# EasyEDA schematic 原理图1.json
TITLE: Sheet_1; REV: 1.0; Date: 2021-03-16; Sheet: 1/1; Drawn By: MonoLogueChi; Company: Your Company
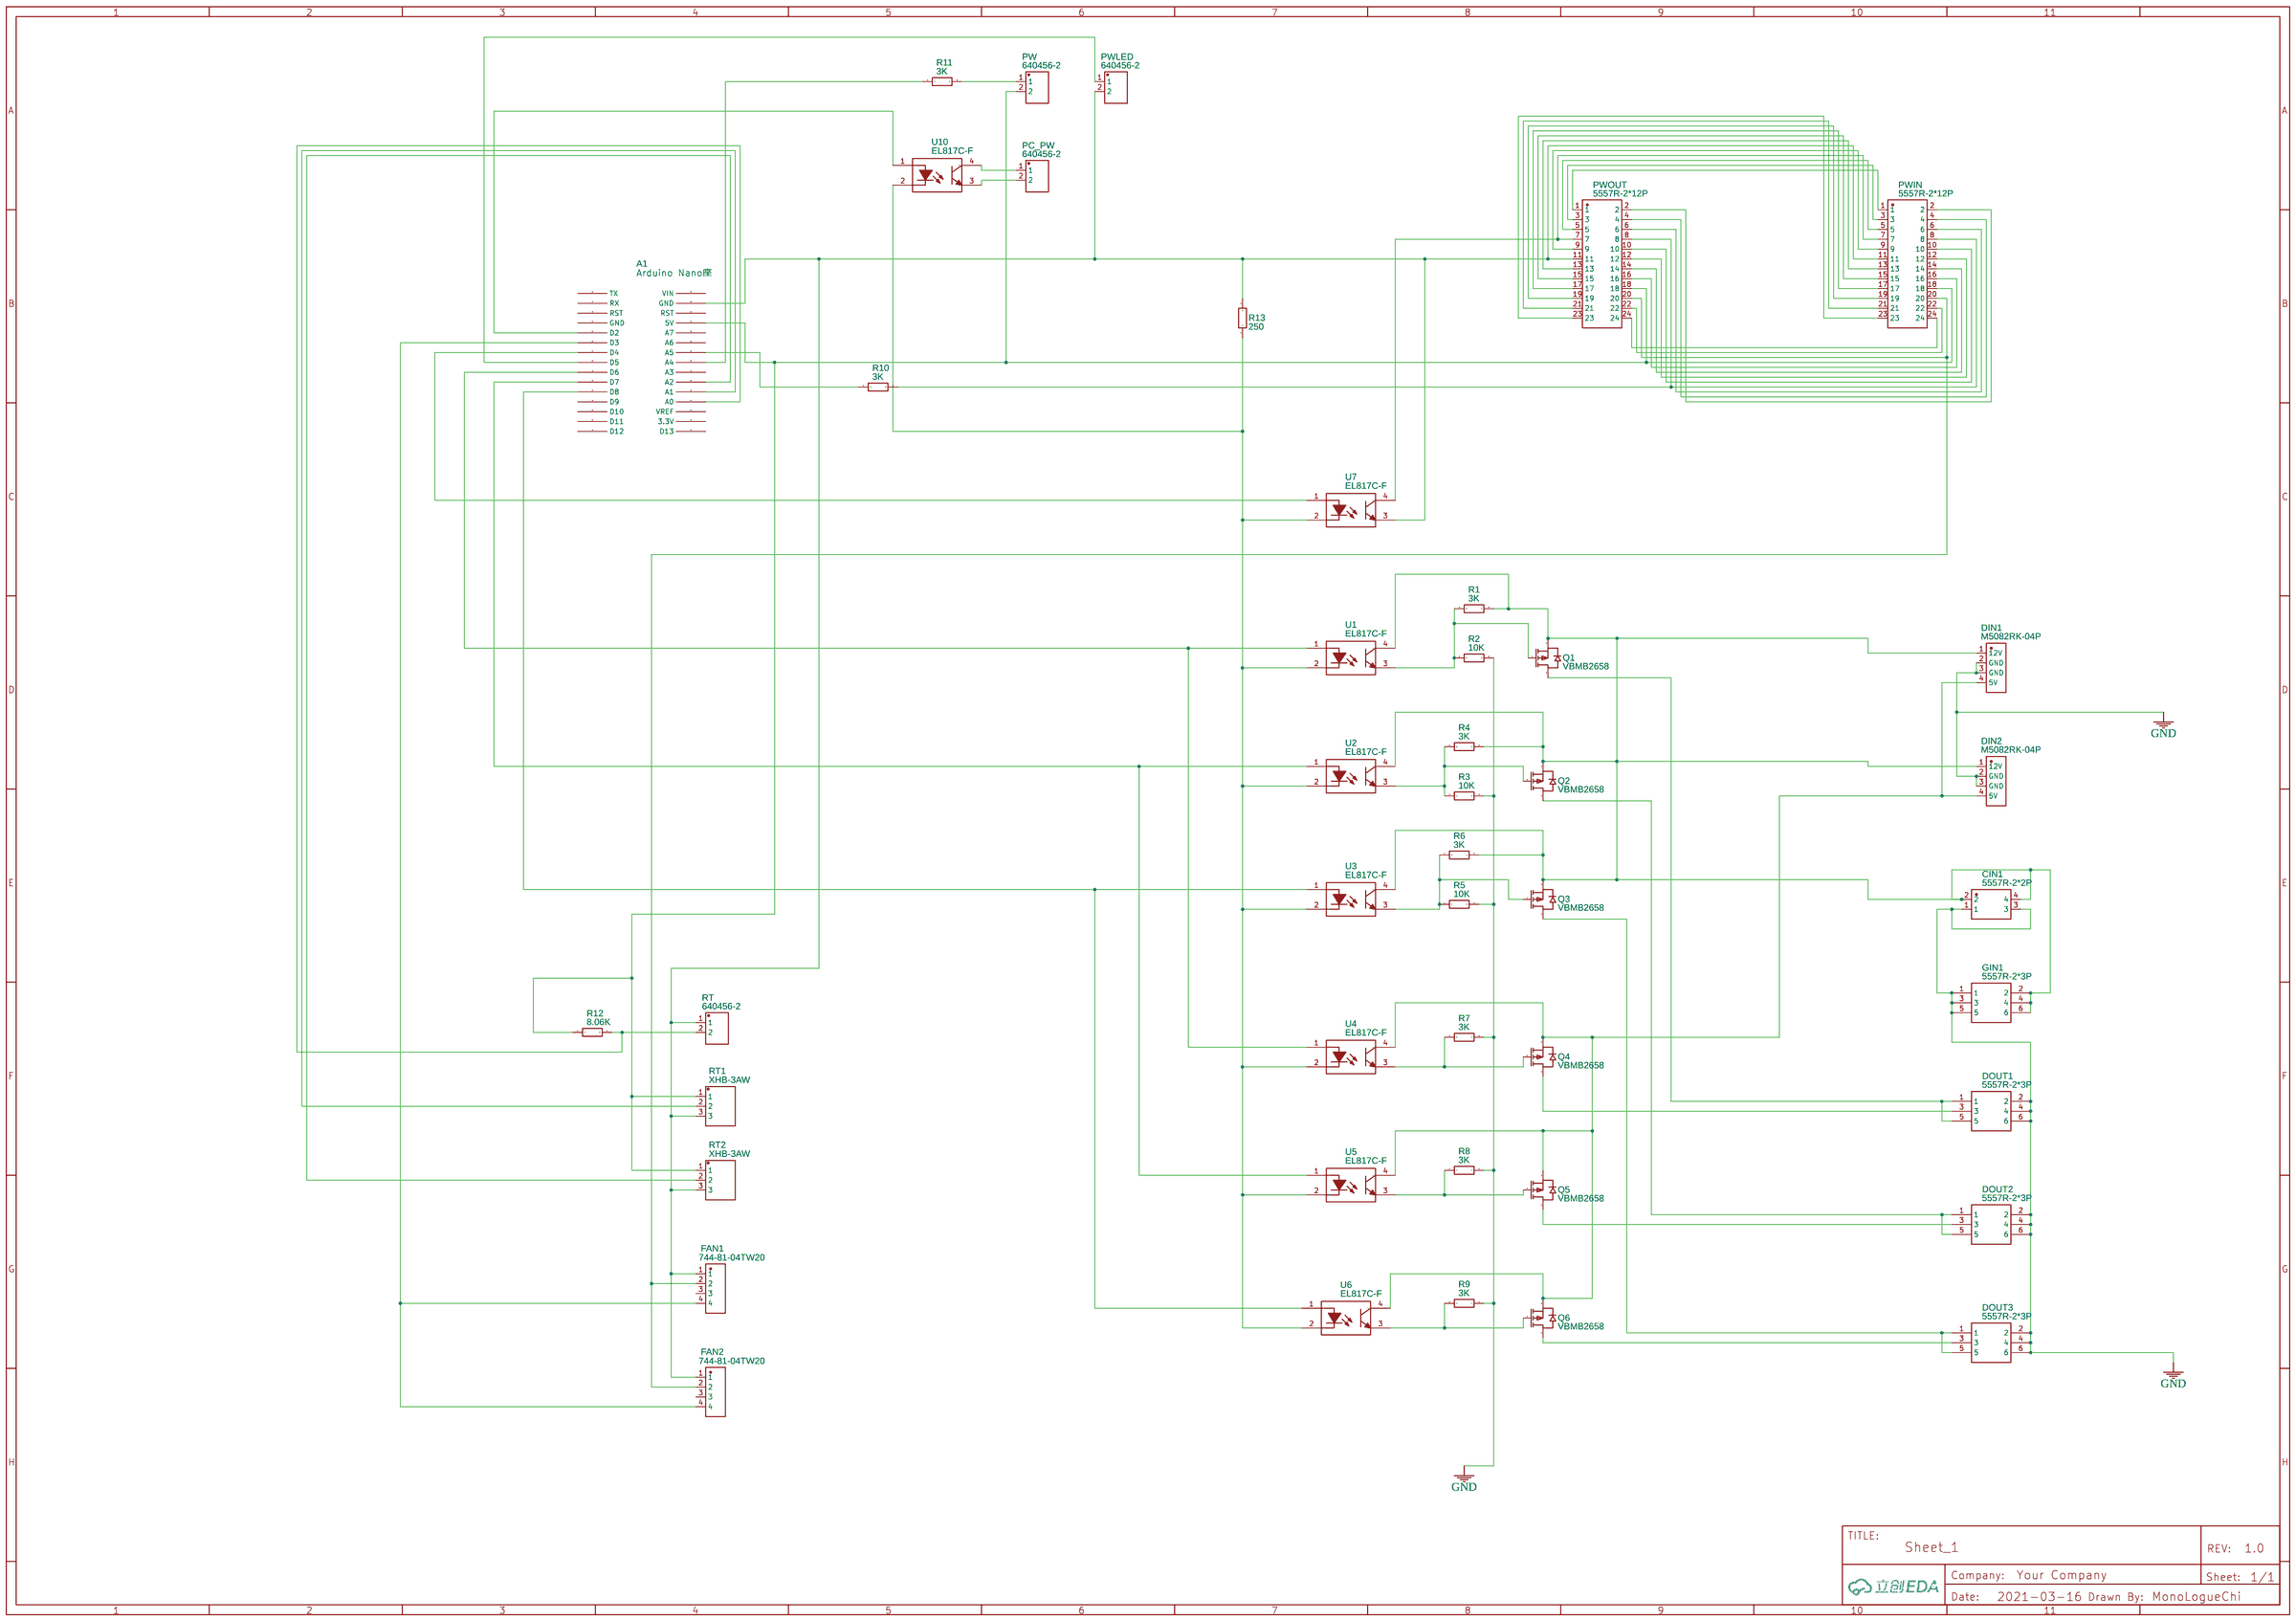
[diagram p0: schematic sheet]

## Parts
A1  Arduino Nano座  [ARDUINO NANO座]
CIN1  5557R-2*2P  [CONN-TH_5557R-2-2P]
DIN1  M5082RK-04P  [CONN-TH_M5082RK-04P]
DIN2  M5082RK-04P  [CONN-TH_M5082RK-04P]
DOUT1  5557R-2*3P  [CONN-TH_5557R-2X3P]
DOUT2  5557R-2*3P  [CONN-TH_5557R-2X3P]
DOUT3  5557R-2*3P  [CONN-TH_5557R-2X3P]
FAN1  744-81-04TW20  [CONN-TH_4P-P2.54-V-M_744-81-04TXXX]
FAN2  744-81-04TW20  [CONN-TH_4P-P2.54-V-M_744-81-04TXXX]
GIN1  5557R-2*3P  [CONN-TH_5557R-2X3P]
PC_PW  640456-2  [CONN-TH_KF2510-2A]
PW  640456-2  [CONN-TH_KF2510-2A]
PWIN  5557R-2*12P  [CONN-TH_24P-P4.20_5557R-2X12P]
PWLED  640456-2  [CONN-TH_KF2510-2A]
PWOUT  5557R-2*12P  [CONN-TH_24P-P4.20_5557R-2X12P]
Q1  VBMB2658  [TO-220F-3_L10.2-W4.9-P2.54-L]
Q2  VBMB2658  [TO-220F-3_L10.2-W4.9-P2.54-L]
Q3  VBMB2658  [TO-220F-3_L10.2-W4.9-P2.54-L]
Q4  VBMB2658  [TO-220F-3_L10.2-W4.9-P2.54-L]
Q5  VBMB2658  [TO-220F-3_L10.2-W4.9-P2.54-L]
Q6  VBMB2658  [TO-220F-3_L10.2-W4.9-P2.54-L]
R1  3K  [RES-TH_BD2.2-L6.5-P10.50-D0.6]
R2  10K  [RES-TH_BD2.5-L6.5-P10.50-D0.6]
R3  10K  [RES-TH_BD2.5-L6.5-P10.50-D0.6]
R4  3K  [RES-TH_BD2.2-L6.5-P10.50-D0.6]
R5  10K  [RES-TH_BD2.5-L6.5-P10.50-D0.6]
R6  3K  [RES-TH_BD2.2-L6.5-P10.50-D0.6]
R7  3K  [RES-TH_BD2.2-L6.5-P10.50-D0.6]
R8  3K  [RES-TH_BD2.2-L6.5-P10.50-D0.6]
R9  3K  [RES-TH_BD2.2-L6.5-P10.50-D0.6]
R10  3K  [RES-TH_BD2.2-L6.5-P10.50-D0.6]
R11  3K  [RES-TH_BD2.2-L6.5-P10.50-D0.6]
R12  8.06K  [RES-TH_BD1.9-L3.3-P7.30-D0.5]
R13  250  [RES-TH_BD2.4-L6.3-P10.30-D0.6]
RT  640456-2  [CONN-TH_KF2510-2A]
RT1  XHB-3AW  [CONN-TH_XHB-3AW]
RT2  XHB-3AW  [CONN-TH_XHB-3AW]
U1  EL817C-F  [DIP-4_L6.4-W4.6-P2.54-LS7.6-BL]
U2  EL817C-F  [DIP-4_L6.4-W4.6-P2.54-LS7.6-BL]
U3  EL817C-F  [DIP-4_L6.4-W4.6-P2.54-LS7.6-BL]
U4  EL817C-F  [DIP-4_L6.4-W4.6-P2.54-LS7.6-BL]
U5  EL817C-F  [DIP-4_L6.4-W4.6-P2.54-LS7.6-BL]
U6  EL817C-F  [DIP-4_L6.4-W4.6-P2.54-LS7.6-BL]
U7  EL817C-F  [DIP-4_L6.4-W4.6-P2.54-LS7.6-BL]
U10  EL817C-F  [DIP-4_L6.4-W4.6-P2.54-LS7.6-BL]

## Library data of the parts
A1 = Arduino Nano座: Manufacturer Part: Arduino Nano; Contributor: shenjunyao; Supplier: EasyEDA; link: https://detail.tmall.com/item.htm?spm=a230r.1.14.6.67e7ea0cXkJQHe&id=595282328171&cm_id=140105335569ed55e27b&abbucket=7; Package Display: No
CIN1 = 5557R-2*2P: Supplier: LCSC; Supplier Part: C132446; Manufacturer: Shenzhen Cankemeng; Contributor: LCSC; Paste Type: expand; Assembly Type: manualWeld
DIN1 DIN2 = M5082RK-04P: Supplier: LCSC; Supplier Part: C492552; Manufacturer: XFCN; Contributor: LCSC; Paste Type: expand; Assembly Type: manualWeld
DOUT1-DOUT3 GIN1 = 5557R-2*3P: Supplier: LCSC; Manufacturer: Ckmtw; Supplier Part: C124425; Paste Type: expand; Assembly Type: manualWeld
FAN1 FAN2 = 744-81-04TW20: Supplier: LCSC; Supplier Part: C402778; Manufacturer: PINREX; Contributor: LCSC; Paste Type: expand; Assembly Type: manualWeld
PC_PW PW PWLED RT = 640456-2: Supplier: LCSC; Manufacturer: TE Connectivity; Supplier Part: C86502
PWIN PWOUT = 5557R-2*12P: Supplier: LCSC; Supplier Part: C477841; Manufacturer: Ckmtw(Shenzhen Cankemeng); Contributor: LCSC; Paste Type: expand; Assembly Type: manualWeld
Q1-Q6 = VBMB2658: Supplier: LCSC; Supplier Part: C481043; Manufacturer: VBsemi Elec; Contributor: LCSC; Paste Type: expand; Assembly Type: manualWeld
R1 R4 R6-R11 = MFR0W4F3001A50: Supplier: LCSC; Manufacturer: UniOhm; Supplier Part: C58606; Paste Type: expand; Assembly Type: manualWeld
R2 R3 R5 = MFR0W4F1002A50: Supplier: LCSC; Manufacturer: UniOhm; Supplier Part: C57436; Paste Type: expand; Assembly Type: manualWeld
R12 = RN16T28061F: Supplier: LCSC; Supplier Part: C172591; Manufacturer: TA-I Tech; Contributor: LCSC; Paste Type: expand; Assembly Type: manualWeld
R13 = MFR-25FTE52-250R: Supplier: LCSC; Supplier Part: C172991; Manufacturer: YAGEO; Contributor: LCSC; Paste Type: expand; Assembly Type: manualWeld
RT1 RT2 = XHB-3AW: Supplier: LCSC; Supplier Part: C95477; Manufacturer: Boom Precision Elec; Contributor: LCSC; Paste Type: expand; Assembly Type: manualWeld
U1-U7 U10 = EL817C-F: Supplier: LCSC; Manufacturer: EVERLIGHT; Supplier Part: C5352

## Nets
GND: CIN1.1 CIN1.3 DIN1.2(GND) DIN1.3(GND) DIN2.2(GND) DIN2.3(GND) DOUT1.2 DOUT1.4 DOUT1.6 DOUT2.2 DOUT2.4 DOUT2.6 DOUT3.2 DOUT3.4 DOUT3.6 GIN1.1 GIN1.3 GIN1.5 R2.2 R3.2 R5.2 R7.2 R8.2 R9.2
Net-(A1-5): A1.5(D2) U10.1
Net-(A1-6): A1.6(D3) FAN1.4 FAN2.4
Net-(A1-7): A1.7(D4) U7.1
Net-(A1-8): A1.8(D5) PWLED.1
Net-(A1-9): A1.9(D6) U1.1 U4.1
Net-(A1-10): A1.10(D7) U2.1 U5.1
Net-(A1-11): A1.11(D8) U3.1 U6.1
Net-(A1-19): A1.19(A0) R12.2 RT.2
Net-(A1-20): A1.20(A1) RT1.2
Net-(A1-21): A1.21(A2) RT2.2
Net-(A1-23): A1.23(A4) R11.1
Net-(A1-24): A1.24(A5) R10.1
Net-(A1-27): A1.27(5V) PW.2 PWIN.18 PWOUT.18 R12.1 RT1.1 RT2.1
Net-(A1-29): A1.29(GND) FAN1.1 FAN2.1 PWIN.11 PWLED.2 PWOUT.11 R13.1 RT.1 RT1.3 RT2.3 U7.3
Net-(CIN1-2): CIN1.2 CIN1.4 DIN1.1(12V) DIN2.1(12V) GIN1.2 GIN1.4 GIN1.6 Q1.3(S) Q2.3(S) Q3.3(S) R1.2 R4.2 R6.2 U1.4 U2.4 U3.4
Net-(DIN1-4): DIN1.4(5V) DIN2.4(5V) Q4.3(S) Q5.3(S) Q6.3(S) U4.4 U5.4 U6.4
Net-(DOUT1-1): DOUT1.1 DOUT1.5 Q1.2(D)
Net-(DOUT1-3): DOUT1.3 Q4.2(D)
Net-(DOUT2-1): DOUT2.1 DOUT2.5 Q2.2(D)
Net-(DOUT2-3): DOUT2.3 Q5.2(D)
Net-(DOUT3-1): DOUT3.1 DOUT3.5 Q3.2(D)
Net-(DOUT3-3): DOUT3.3 Q6.2(D)
Net-(FAN1-2): FAN1.2 FAN2.2 PWIN.20 PWOUT.20
Net-(PC_PW-1): PC_PW.1 U10.4
Net-(PC_PW-2): PC_PW.2 U10.3
Net-(PW-1): PW.1 R11.2
Net-(PWIN-1): PWIN.1 PWOUT.1
Net-(PWIN-2): PWIN.2 PWOUT.2
Net-(PWIN-3): PWIN.3 PWOUT.3
Net-(PWIN-4): PWIN.4 PWOUT.4
Net-(PWIN-5): PWIN.5 PWOUT.5
Net-(PWIN-6): PWIN.6 PWOUT.6
Net-(PWIN-7): PWIN.7 PWOUT.7 U7.4
Net-(PWIN-8): PWIN.8 PWOUT.8 R10.2
Net-(PWIN-9): PWIN.9 PWOUT.9
Net-(PWIN-10): PWIN.10 PWOUT.10
Net-(PWIN-12): PWIN.12 PWOUT.12
Net-(PWIN-13): PWIN.13 PWOUT.13
Net-(PWIN-14): PWIN.14 PWOUT.14
Net-(PWIN-15): PWIN.15 PWOUT.15
Net-(PWIN-16): PWIN.16 PWOUT.16
Net-(PWIN-17): PWIN.17 PWOUT.17
Net-(PWIN-19): PWIN.19 PWOUT.19
Net-(PWIN-21): PWIN.21 PWOUT.21
Net-(PWIN-22): PWIN.22 PWOUT.22
Net-(PWIN-23): PWIN.23 PWOUT.23
Net-(PWIN-24): PWIN.24 PWOUT.24
Net-(Q1-1): Q1.1(G) R1.1 R2.1 U1.3
Net-(Q2-1): Q2.1(G) R3.1 R4.1 U2.3
Net-(Q3-1): Q3.1(G) R5.1 R6.1 U3.3
Net-(Q4-1): Q4.1(G) R7.1 U4.3
Net-(Q5-1): Q5.1(G) R8.1 U5.3
Net-(Q6-1): Q6.1(G) R9.1 U6.3
Net-(R13-2): R13.2 U1.2 U2.2 U3.2 U4.2 U5.2 U6.2 U7.2 U10.2

Not connected (* = marked no-connect by the designer): A1 1(TX) 2(RX) 3(RST) 4(GND) 12(D9) 13(D10) 14(D11) 15(D12) 16(D13) 17(3.3V) 18(VREF) 22(A3) 25(A6) 26(A7) 28(RST) 30(VIN); FAN1 3; FAN2 3
